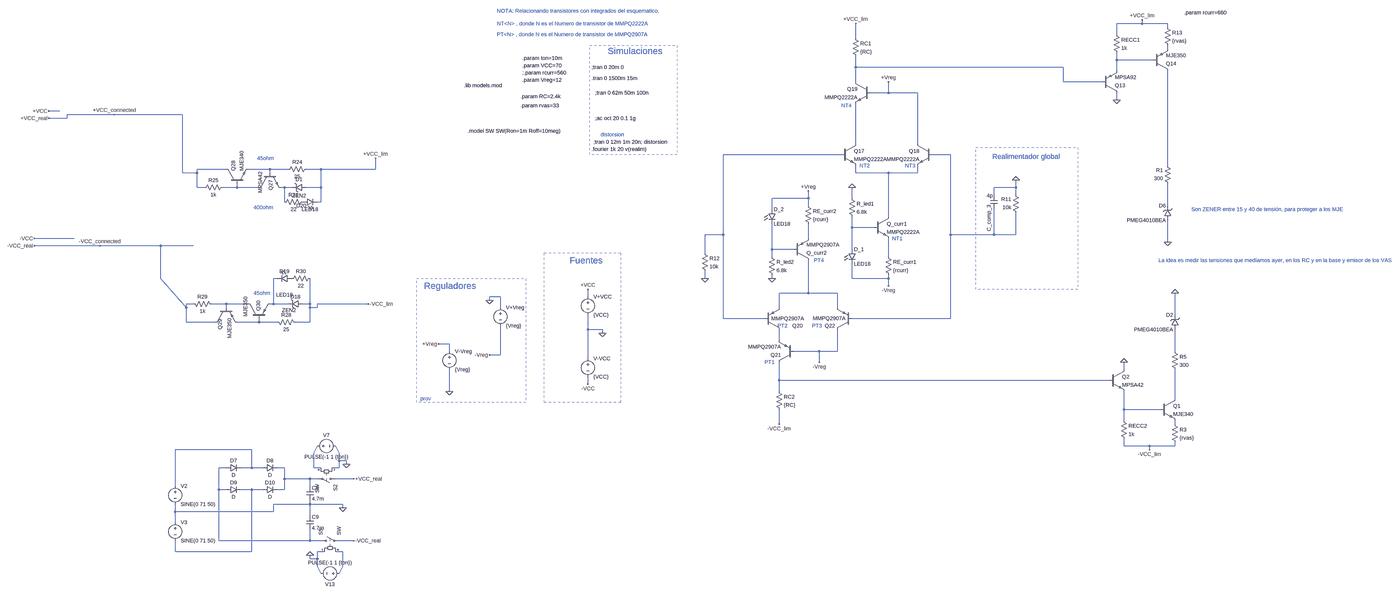
[diagram p0: schematic segunda-etapa-v2B.asc, whole sheet]
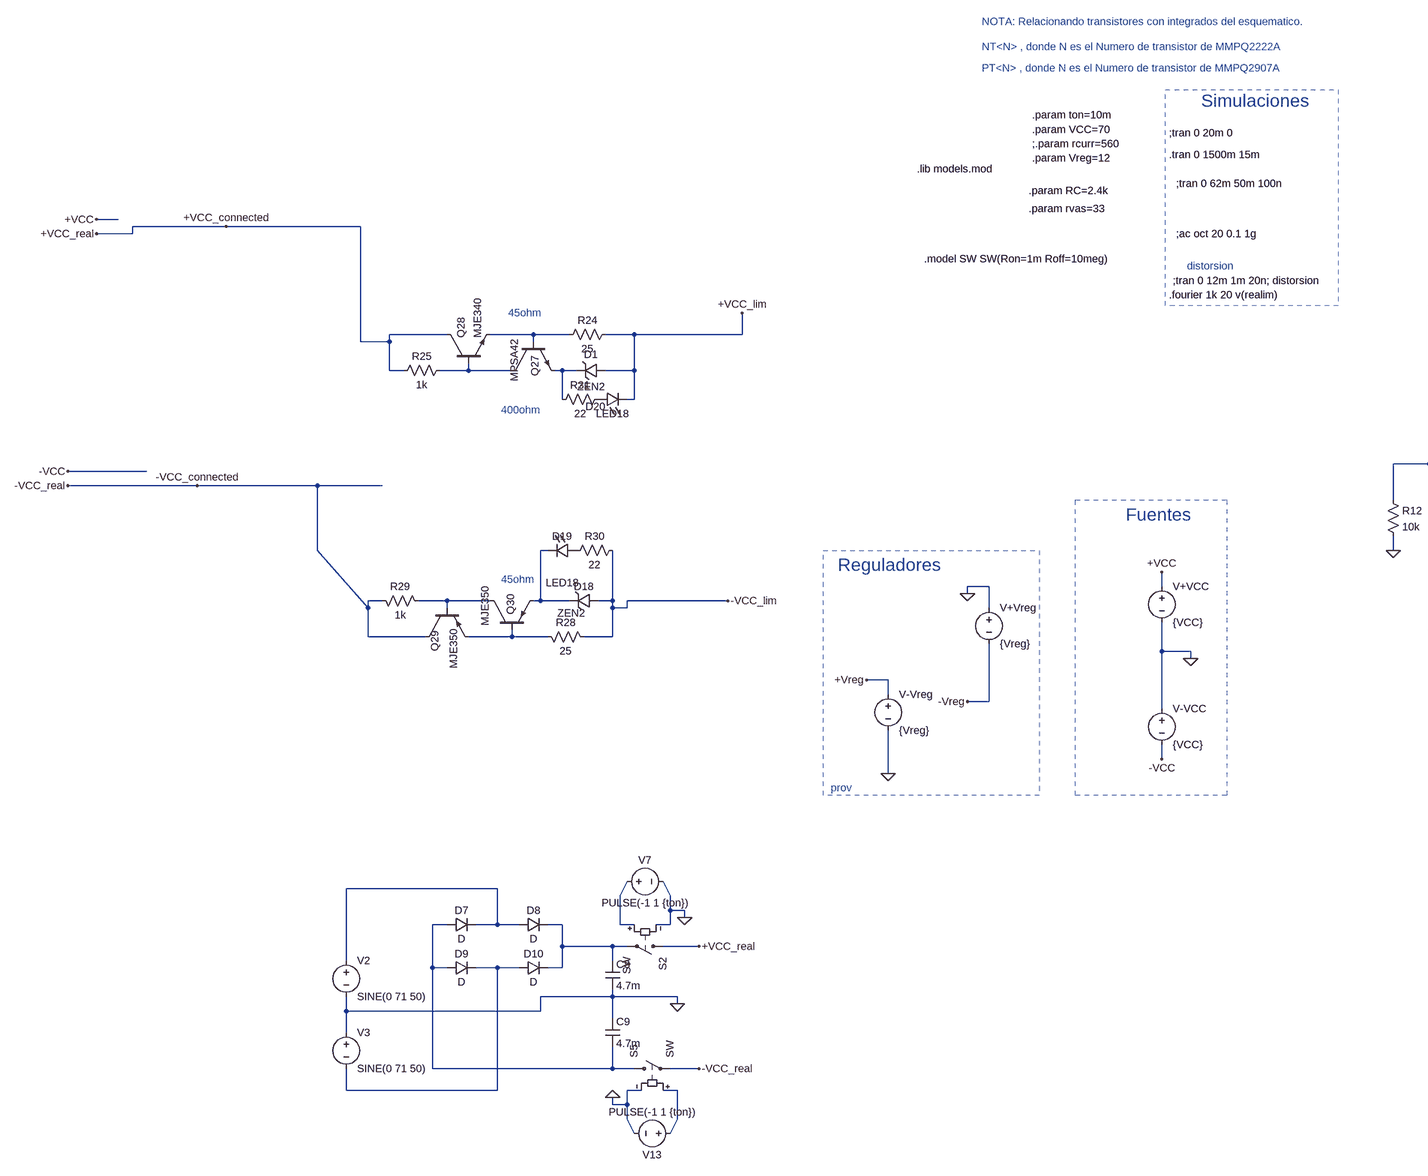
[diagram p1: schematic segunda-etapa-v2B.asc, part, row 1 of 1, column 1 of 2]
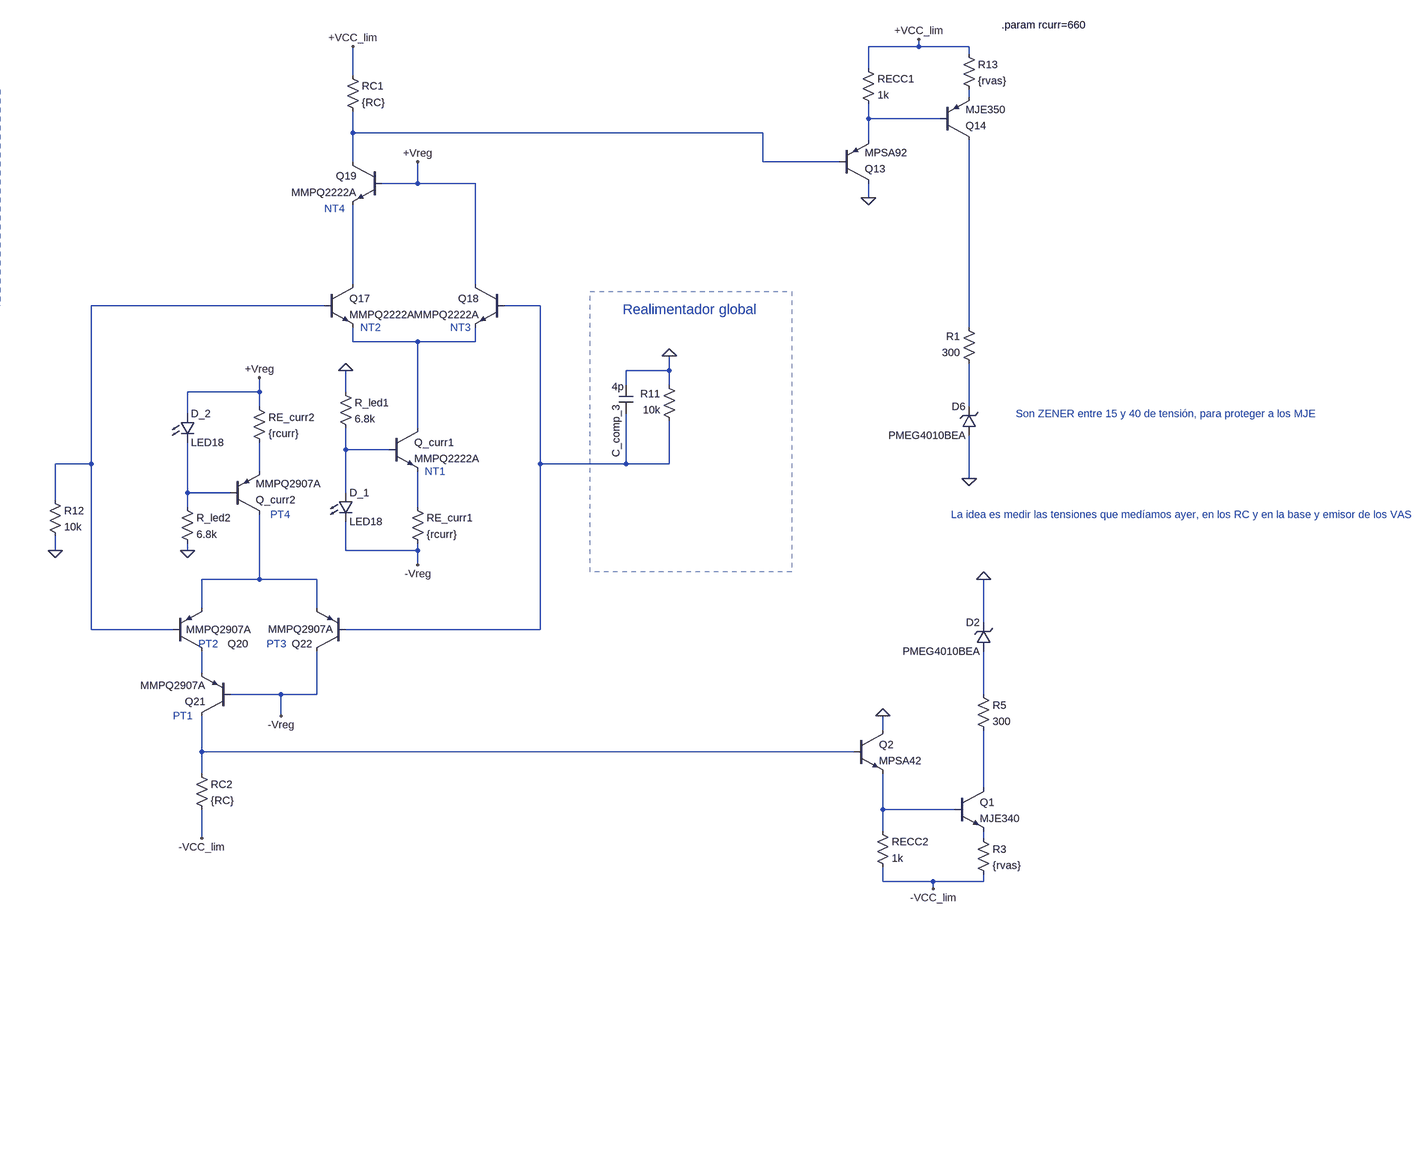
[diagram p2: schematic segunda-etapa-v2B.asc, part, row 1 of 1, column 2 of 2]
segunda-etapa-v2B.asc, the LTspice schematic file:
Version 4
SHEET 1 6132 2164
WIRE 1792 -752 1792 -768
WIRE 1792 -752 1680 -752
WIRE 1904 -752 1792 -752
WIRE 1904 -736 1904 -752
WIRE 1680 -704 1680 -752
WIRE 464 -688 464 -752
WIRE 1904 -640 1904 -656
WIRE 1680 -592 1680 -624
WIRE 1840 -592 1680 -592
WIRE 464 -560 464 -608
WIRE 1392 -560 464 -560
WIRE 1680 -544 1680 -592
WIRE 464 -496 464 -560
WIRE 1392 -496 1392 -560
WIRE 1616 -496 1392 -496
WIRE 608 -448 608 -496
WIRE 608 -448 528 -448
WIRE 736 -448 608 -448
WIRE 1680 -416 1680 -448
WIRE -3600 -368 -3648 -368
WIRE -3360 -352 -3568 -352
WIRE -3056 -352 -3360 -352
WIRE -3568 -336 -3568 -352
WIRE -3568 -336 -3648 -336
WIRE 464 -224 464 -400
WIRE 736 -224 736 -448
WIRE 400 -176 -128 -176
WIRE 880 -176 800 -176
WIRE 1904 -128 1904 -544
WIRE -2864 -112 -2992 -112
WIRE -2672 -112 -2768 -112
WIRE -2592 -112 -2672 -112
WIRE -2448 -112 -2512 -112
WIRE -2208 -112 -2208 -160
WIRE -2208 -112 -2448 -112
WIRE -3056 -96 -3056 -352
WIRE -2992 -96 -2992 -112
WIRE -2992 -96 -3056 -96
WIRE -2672 -96 -2672 -112
WIRE 464 -96 464 -128
WIRE 608 -96 464 -96
WIRE 736 -96 736 -128
WIRE 736 -96 608 -96
WIRE -2992 -32 -2992 -96
WIRE -2960 -32 -2992 -32
WIRE -2816 -32 -2816 -48
WIRE -2816 -32 -2880 -32
WIRE -2720 -32 -2816 -32
WIRE -2608 -32 -2624 -32
WIRE -2576 -32 -2608 -32
WIRE -2448 -32 -2448 -112
WIRE -2448 -32 -2512 -32
WIRE 1184 -32 1184 -64
WIRE 1184 -32 1088 -32
WIRE 1088 0 1088 -32
WIRE 1184 0 1184 -32
WIRE 256 16 256 -16
WIRE 256 16 96 16
WIRE 448 16 448 -32
WIRE -2608 32 -2608 -32
WIRE -2448 32 -2448 -32
WIRE -2448 32 -2464 32
WIRE 256 48 256 16
WIRE 1904 48 1904 -48
WIRE 96 64 96 16
WIRE 608 96 608 -96
WIRE 448 144 448 96
WIRE 544 144 448 144
WIRE -128 176 -128 -176
WIRE -128 176 -208 176
WIRE 880 176 880 -176
WIRE 1088 176 1088 64
WIRE 1088 176 880 176
WIRE 1184 176 1184 80
WIRE 1184 176 1088 176
WIRE -3536 192 -3712 192
WIRE 256 192 256 128
WIRE 1904 208 1904 112
WIRE -3424 224 -3712 224
WIRE -3152 224 -3424 224
WIRE -3008 224 -3152 224
WIRE 96 240 96 128
WIRE 192 240 96 240
WIRE 448 240 448 144
WIRE -208 256 -208 176
WIRE 96 272 96 240
WIRE 608 272 608 192
WIRE -3152 368 -3152 224
WIRE -2640 368 -2656 368
WIRE -208 368 -208 336
WIRE 96 368 96 352
WIRE 448 368 448 304
WIRE 608 368 608 352
WIRE 608 368 448 368
WIRE 608 400 608 368
WIRE 256 432 256 288
WIRE 256 432 128 432
WIRE 384 432 256 432
WIRE -1568 448 -1616 448
WIRE -1184 448 -1184 416
WIRE -1616 464 -1616 448
WIRE -3008 480 -3040 480
WIRE -2864 480 -2928 480
WIRE -2768 480 -2864 480
WIRE -2656 480 -2656 368
WIRE -2656 480 -2672 480
WIRE -2592 480 -2656 480
WIRE -2496 480 -2496 368
WIRE -2496 480 -2528 480
WIRE -2240 480 -2464 480
WIRE -3040 496 -3152 368
WIRE -3040 496 -3040 480
WIRE -2864 496 -2864 480
WIRE -2496 496 -2496 480
WIRE -2464 496 -2464 480
WIRE -2464 496 -2496 496
WIRE -1568 496 -1568 448
WIRE 128 496 128 432
WIRE 384 496 384 432
WIRE 1936 528 1936 432
WIRE -128 544 -128 176
WIRE 64 544 -128 544
WIRE 880 544 880 176
WIRE 880 544 448 544
WIRE -3040 560 -3040 496
WIRE -2912 560 -3040 560
WIRE -2720 560 -2720 544
WIRE -2720 560 -2816 560
WIRE -2640 560 -2720 560
WIRE -2496 560 -2496 496
WIRE -2496 560 -2560 560
WIRE -1184 592 -1184 528
WIRE -1120 592 -1184 592
WIRE -1120 608 -1120 592
WIRE 128 640 128 592
WIRE -1792 656 -1840 656
WIRE -1792 688 -1792 656
WIRE 304 688 192 688
WIRE 384 688 384 592
WIRE 384 688 304 688
WIRE 1936 688 1936 592
WIRE -1568 704 -1568 576
WIRE -1568 704 -1616 704
WIRE -1184 720 -1184 592
WIRE 304 736 304 688
WIRE 1712 768 1712 736
WIRE 128 816 128 736
WIRE 1648 816 128 816
WIRE -1184 832 -1184 800
WIRE -1792 864 -1792 768
WIRE 128 864 128 816
WIRE 1936 896 1936 768
WIRE 1712 944 1712 864
WIRE 1872 944 1712 944
WIRE 1712 992 1712 944
WIRE 128 1008 128 944
WIRE 1936 1008 1936 992
WIRE 1712 1104 1712 1072
WIRE 1824 1104 1712 1104
WIRE 1936 1104 1936 1088
WIRE 1936 1104 1824 1104
WIRE -2752 1120 -3088 1120
WIRE 1824 1120 1824 1104
WIRE -2480 1136 -2464 1104
WIRE -2368 1136 -2384 1104
WIRE -2368 1168 -2368 1136
WIRE -2336 1168 -2368 1168
WIRE -2336 1184 -2336 1168
WIRE -2864 1200 -2896 1200
WIRE -2752 1200 -2752 1120
WIRE -2752 1200 -2800 1200
WIRE -2704 1200 -2752 1200
WIRE -2608 1200 -2640 1200
WIRE -2480 1200 -2480 1136
WIRE -2448 1200 -2480 1200
WIRE -2368 1200 -2368 1168
WIRE -2368 1200 -2400 1200
WIRE -2608 1248 -2608 1200
WIRE -2496 1248 -2608 1248
WIRE -2464 1248 -2496 1248
WIRE -2304 1248 -2384 1248
WIRE -3088 1280 -3088 1120
WIRE -2496 1280 -2496 1248
WIRE -2896 1296 -2896 1200
WIRE -2864 1296 -2896 1296
WIRE -2752 1296 -2800 1296
WIRE -2704 1296 -2752 1296
WIRE -2608 1296 -2608 1248
WIRE -2608 1296 -2640 1296
WIRE -2496 1360 -2496 1344
WIRE -2496 1360 -2656 1360
WIRE -2352 1360 -2496 1360
WIRE -2352 1376 -2352 1360
WIRE -3088 1392 -3088 1360
WIRE -2656 1392 -2656 1360
WIRE -2656 1392 -3088 1392
WIRE -2496 1408 -2496 1360
WIRE -3088 1440 -3088 1392
WIRE -2896 1520 -2896 1296
WIRE -2496 1520 -2496 1472
WIRE -2496 1520 -2896 1520
WIRE -2448 1520 -2496 1520
WIRE -2304 1520 -2368 1520
WIRE -3088 1568 -3088 1520
WIRE -2752 1568 -2752 1296
WIRE -2752 1568 -3088 1568
WIRE -2432 1568 -2464 1568
WIRE -2352 1568 -2384 1568
WIRE -2496 1600 -2496 1584
WIRE -2464 1600 -2464 1568
WIRE -2464 1600 -2496 1600
WIRE -2464 1632 -2464 1600
WIRE -2352 1632 -2352 1568
WIRE -2448 1664 -2464 1632
WIRE -2368 1664 -2352 1632
FLAG -1120 608 0
FLAG -1184 416 +VCC
FLAG -1184 832 -VCC
FLAG -208 368 0
FLAG 1680 -416 0
FLAG -1840 656 +Vreg
FLAG -1616 704 -Vreg
FLAG 608 -496 +Vreg
FLAG 608 400 -Vreg
FLAG 256 -16 +Vreg
FLAG 304 736 -Vreg
FLAG 96 368 0
FLAG 448 -32 0
FLAG -1792 864 0
FLAG -1616 464 0
FLAG -2304 1248 +VCC_real
FLAG -2304 1520 -VCC_real
FLAG -2336 1184 0
FLAG -3360 -352 +VCC_connected
FLAG -3424 224 -VCC_connected
FLAG -3648 -368 +VCC
FLAG -3648 -336 +VCC_real
FLAG -3712 192 -VCC
FLAG -3712 224 -VCC_real
FLAG -2496 1584 0
FLAG 464 -752 +VCC_lim
FLAG 128 1008 -VCC_lim
FLAG 1792 -768 +VCC_lim
FLAG -2208 -160 +VCC_lim
FLAG -2240 480 -VCC_lim
FLAG 1184 -64 0
FLAG -2352 1376 0
FLAG 1904 208 0
FLAG 1712 736 0
FLAG 1824 1120 -VCC_lim
FLAG 1936 432 0
SYMBOL voltage -1184 432 R0
WINDOW 123 0 0 Left 2
WINDOW 39 0 0 Left 2
SYMATTR InstName V+VCC
SYMATTR Value {VCC}
SYMBOL voltage -1184 704 R0
WINDOW 123 0 0 Left 2
WINDOW 39 0 0 Left 2
SYMATTR InstName V-VCC
SYMATTR Value {VCC}
SYMBOL res 1200 96 R180
WINDOW 0 36 76 Left 2
WINDOW 3 36 40 Left 2
SYMATTR InstName R11
SYMATTR Value 10k
SYMBOL res -224 240 R0
SYMATTR InstName R12
SYMATTR Value 10k
SYMBOL pnp 1616 -448 M180
SYMATTR InstName Q13
SYMATTR Value MPSA92
SYMBOL pnp 1840 -544 M180
SYMATTR InstName Q14
SYMATTR Value MJE350
SYMBOL res 1888 -752 R0
SYMATTR InstName R13
SYMATTR Value {rvas}
SYMBOL cap 1104 64 R180
WINDOW 0 38 20 VLeft 2
WINDOW 3 21 60 Left 2
SYMATTR InstName C_comp_3
SYMATTR Value 4p
SYMBOL voltage -1568 480 R0
WINDOW 123 0 0 Left 2
WINDOW 39 0 0 Left 2
SYMATTR InstName V+Vreg
SYMATTR Value {Vreg}
SYMBOL npn 544 96 R0
SYMATTR InstName Q_curr1
SYMATTR Value MMPQ2222A
SYMBOL npn 400 -224 R0
SYMATTR InstName Q17
SYMATTR Value MMPQ2222A
SYMBOL npn 800 -224 M0
SYMATTR InstName Q18
SYMATTR Value MMPQ2222A
SYMBOL res 432 0 R0
SYMATTR InstName R_led1
SYMATTR Value 6.8k
SYMBOL res 592 256 R0
SYMATTR InstName RE_curr1
SYMATTR Value {rcurr}
SYMBOL LED 432 240 R0
SYMATTR InstName D_1
SYMATTR Value LED18
SYMBOL res 448 -704 R0
SYMATTR InstName RC1
SYMATTR Value {RC}
SYMBOL npn 528 -496 M0
SYMATTR InstName Q19
SYMATTR Value MMPQ2222A
SYMBOL res 240 32 R0
SYMATTR InstName RE_curr2
SYMATTR Value {rcurr}
SYMBOL pnp 192 288 M180
SYMATTR InstName Q_curr2
SYMATTR Value MMPQ2907A
SYMBOL pnp 64 592 M180
WINDOW 0 121 16 Left 2
WINDOW 3 29 48 Left 2
SYMATTR InstName Q20
SYMATTR Value MMPQ2907A
SYMBOL pnp 192 736 R180
SYMATTR InstName Q21
SYMATTR Value MMPQ2907A
SYMBOL res 112 848 R0
SYMATTR InstName RC2
SYMATTR Value {RC}
SYMBOL pnp 448 592 R180
WINDOW 0 74 16 Left 2
WINDOW 3 28 49 Left 2
SYMATTR InstName Q22
SYMATTR Value MMPQ2907A
SYMBOL LED 80 64 R0
SYMATTR InstName D_2
SYMATTR Value LED18
SYMBOL res 80 256 R0
SYMATTR InstName R_led2
SYMATTR Value 6.8k
SYMBOL res 1664 -720 R0
SYMATTR InstName RECC1
SYMATTR Value 1k
SYMBOL voltage -1792 672 R0
WINDOW 123 0 0 Left 2
WINDOW 39 0 0 Left 2
SYMATTR InstName V-Vreg
SYMATTR Value {Vreg}
SYMBOL voltage -3088 1264 R0
WINDOW 123 0 0 Left 2
WINDOW 39 0 0 Left 2
SYMATTR InstName V2
SYMATTR Value SINE(0 71 50)
SYMBOL diode -2864 1216 R270
WINDOW 0 32 32 VTop 2
WINDOW 3 0 32 VBottom 2
SYMATTR InstName D7
SYMBOL diode -2704 1216 R270
WINDOW 0 32 32 VTop 2
WINDOW 3 0 32 VBottom 2
SYMATTR InstName D8
SYMBOL diode -2864 1312 R270
WINDOW 0 32 32 VTop 2
WINDOW 3 0 32 VBottom 2
SYMATTR InstName D9
SYMBOL diode -2704 1312 R270
WINDOW 0 32 32 VTop 2
WINDOW 3 0 32 VBottom 2
SYMATTR InstName D10
SYMBOL cap -2512 1280 R0
SYMATTR InstName C8
SYMATTR Value 4.7m
SYMBOL voltage -3088 1424 R0
WINDOW 123 0 0 Left 2
WINDOW 39 0 0 Left 2
SYMATTR InstName V3
SYMATTR Value SINE(0 71 50)
SYMBOL cap -2512 1408 R0
SYMATTR InstName C9
SYMATTR Value 4.7m
SYMBOL sw -2368 1248 R90
SYMATTR InstName S2
SYMBOL voltage -2480 1104 R270
WINDOW 0 32 56 VTop 2
WINDOW 3 -32 56 VBottom 2
WINDOW 123 0 0 Left 2
WINDOW 39 0 0 Left 2
SYMATTR InstName V7
SYMATTR Value PULSE(-1 1 {ton})
SYMBOL sw -2464 1520 R270
SYMATTR InstName S5
SYMBOL voltage -2352 1664 R90
WINDOW 0 32 56 VTop 2
WINDOW 3 -32 56 VBottom 2
WINDOW 123 0 0 Left 2
WINDOW 39 0 0 Left 2
SYMATTR InstName V13
SYMATTR Value PULSE(-1 1 {ton})
SYMBOL res -2496 -128 R90
WINDOW 0 0 56 VBottom 2
WINDOW 3 32 56 VTop 2
SYMATTR InstName R24
SYMATTR Value 25
SYMBOL res -2864 -48 R90
WINDOW 0 0 56 VBottom 2
WINDOW 3 32 56 VTop 2
SYMATTR InstName R25
SYMATTR Value 1k
SYMBOL npn -2720 -96 M90
WINDOW 0 32 52 Left 2
WINDOW 3 -6 6 Left 2
SYMATTR InstName Q27
SYMATTR Value MPSA42
SYMBOL npn -2864 -48 R270
SYMATTR InstName Q28
SYMATTR Value MJE340
SYMBOL res -2544 576 M270
WINDOW 0 32 56 VTop 2
WINDOW 3 0 56 VBottom 2
SYMATTR InstName R28
SYMATTR Value 25
SYMBOL res -2912 496 M270
WINDOW 0 32 56 VTop 2
WINDOW 3 0 56 VBottom 2
SYMATTR InstName R29
SYMATTR Value 1k
SYMBOL pnp -2912 496 M90
WINDOW 0 51 21 Left 2
WINDOW 3 46 63 Left 2
SYMATTR InstName Q29
SYMATTR Value MJE350
SYMBOL pnp -2768 544 R270
WINDOW 0 33 46 Left 2
WINDOW 3 8 -11 Left 2
SYMATTR InstName Q30
SYMATTR Value MJE350
SYMBOL zener -2528 464 R90
WINDOW 0 0 32 VBottom 2
WINDOW 3 28 60 VTop 2
SYMATTR InstName D18
SYMATTR Value ZEN2
SYMATTR Description Light Emitting Diode
SYMATTR Type led
SYMBOL LED -2576 352 R90
WINDOW 0 0 32 VBottom 2
WINDOW 3 72 32 VTop 2
SYMATTR InstName D19
SYMATTR Value LED18
SYMBOL res -2480 352 R90
WINDOW 0 0 56 VBottom 2
WINDOW 3 32 56 VTop 2
SYMATTR InstName R30
SYMATTR Value 22
SYMBOL LED -2528 48 R270
WINDOW 0 -16 -6 VTop 2
WINDOW 3 0 32 VBottom 2
SYMATTR InstName D20
SYMATTR Value LED18
SYMBOL res -2512 16 R90
WINDOW 0 0 56 VBottom 2
WINDOW 3 32 56 VTop 2
SYMATTR InstName R31
SYMATTR Value 22
SYMBOL zener -2512 -48 R90
WINDOW 0 -4 32 VBottom 2
WINDOW 3 36 32 VTop 2
SYMATTR InstName D1
SYMATTR Value ZEN2
SYMBOL res 1920 -32 R180
WINDOW 0 36 76 Left 2
WINDOW 3 36 40 Left 2
SYMATTR InstName R1
SYMATTR Value 300
SYMBOL rui\\shortcuts\\zener 1920 112 R180
WINDOW 0 24 64 Left 2
WINDOW 3 24 0 Left 2
SYMATTR InstName D6
SYMATTR Value PMEG4010BEA
SYMBOL npn 1872 896 R0
SYMATTR InstName Q1
SYMATTR Value MJE340
SYMBOL res 1920 992 R0
SYMATTR InstName R3
SYMATTR Value {rvas}
SYMBOL npn 1648 768 R0
SYMATTR InstName Q2
SYMATTR Value MPSA42
SYMBOL res 1696 976 R0
SYMATTR InstName RECC2
SYMATTR Value 1k
SYMBOL res 1920 672 R0
SYMATTR InstName R5
SYMATTR Value 300
SYMBOL rui\\shortcuts\\zener 1952 592 R180
WINDOW 0 24 64 Left 2
WINDOW 3 24 0 Left 2
SYMATTR InstName D2
SYMATTR Value PMEG4010BEA
TEXT -1168 -560 Left 2 !;tran 0 20m 0
TEXT -1168 -200 Left 2 !.fourier 1k 20 v(realim)
TEXT -1264 288 Left 4 ;Fuentes
TEXT -1096 -632 Left 4 ;Simulaciones
TEXT -1160 -232 Left 2 !;tran 0 12m 1m 20n; distorsion
TEXT -1128 -264 Left 2 ;distorsion
TEXT -1152 -336 Left 2 !;ac oct 20 0.1 1g
TEXT -1728 -480 Left 2 !.lib models.mod
TEXT -1904 400 Left 4 ;Reguladores
TEXT -1920 896 Left 2 ;prov
TEXT 1080 -168 Left 3 ;Realimentador global
TEXT 480 -128 Left 2 ;NT2
TEXT 680 -128 Left 2 ;NT3
TEXT 624 192 Left 2 ;NT1
TEXT 400 -392 Left 2 ;NT4
TEXT 120 576 Left 2 ;PT2
TEXT -1584 -752 Left 2 ;NT<N> , donde N es el Numero de transistor de MMPQ2222A
TEXT -1584 -704 Left 2 ;PT<N> , donde N es el Numero de transistor de MMPQ2907A
TEXT -1584 -808 Left 2 ;NOTA: Relacionando transistores con integrados del esquematico.
TEXT 64 736 Left 2 ;PT1
TEXT 272 576 Left 2 ;PT3
TEXT 280 288 Left 2 ;PT4
TEXT -1472 -568 Left 2 !.param VCC=70
TEXT -1472 -504 Left 2 !.param Vreg=12
TEXT -1480 -432 Left 2 !.param RC=2.4k
TEXT -1480 -392 Left 2 !.param rvas=33
TEXT -1168 -512 Left 2 !.tran 0 1500m 15m
TEXT -1472 -600 Left 2 !.param ton=10m
TEXT -1152 -448 Left 2 !;tran 0 62m 50m 100n
TEXT -1472 -536 Left 2 !;.param rcurr=560
TEXT -2744 56 Left 2 ;400ohm
TEXT -2728 -160 Left 2 ;45ohm
TEXT -2744 432 Left 2 ;45ohm
TEXT -1712 -280 Left 2 !.model SW SW(Ron=1m Roff=10meg)
TEXT 1976 -800 Left 2 !.param rcurr=660
TEXT 2008 64 Left 2 ;Son ZENER entre 15 y 40 de tensión, para proteger a los MJE
TEXT 1864 288 Left 2 ;La idea es medir las tensiones que medíamos ayer, en los RC y en la base y emisor de los VAS
RECTANGLE Normal -1040 912 -1376 256 2
RECTANGLE Normal -792 -176 -1176 -656 2
RECTANGLE Normal -1456 912 -1936 368 2
RECTANGLE Normal 1456 416 1008 -208 2

The netlist it stands for:
* segunda-etapa-v2B.asc
V+VCC +VCC 0 {VCC}
V-VCC 0 -VCC {VCC}
R11 N006 0 10k
R12 N005 0 10k
Q13 0 N003 N002 0 MPSA92
Q14 N007 N002 N001 0 MJE350
R13 +VCC_lim N001 {rvas}
C_comp_3 N006 0 4p
V+Vreg 0 -Vreg {Vreg}
Q_curr1 N009 N013 N016 0 MMPQ2222A
Q17 N004 N005 N009 0 MMPQ2222A
Q18 +Vreg N006 N009 0 MMPQ2222A
R_led1 0 N013 6.8k
RE_curr1 N016 -Vreg {rcurr}
D_1 N013 -Vreg LED18
RC1 +VCC_lim N003 {RC}
Q19 N003 +Vreg N004 0 MMPQ2222A
RE_curr2 +Vreg N014 {rcurr}
Q_curr2 N018 N015 N014 0 MMPQ2907A
Q20 N021 N005 N018 0 MMPQ2907A
Q21 N023 -Vreg N021 0 MMPQ2907A
RC2 N023 -VCC_lim {RC}
Q22 -Vreg N006 N018 0 MMPQ2907A
D_2 +Vreg N015 LED18
R_led2 N015 0 6.8k
RECC1 +VCC_lim N002 1k
V-Vreg +Vreg 0 {Vreg}
V2 N027 0 SINE(0 71 50)
D7 N029 N027 D
D8 N027 N030 D
D9 N029 N031 D
D10 N031 N030 D
C8 N030 0 4.7m
V3 0 N031 SINE(0 71 50)
C9 0 N029 4.7m
S2 +VCC_connected N030 N028 0 SW
V7 N028 0 PULSE(-1 1 {ton})
S5 N029 -VCC_connected N032 0 SW
V13 N032 0 PULSE(-1 1 {ton})
R24 +VCC_lim N008 25
R25 N010 +VCC_connected 1k
Q27 N010 N008 N011 0 MPSA42
Q28 +VCC_connected N010 N008 0 MJE340
R28 -VCC_lim N020 25
R29 N019 -VCC_connected 1k
Q29 -VCC_connected N019 N020 0 MJE350
Q30 N019 N020 N017 0 MJE350
D18 -VCC_lim N017 ZEN2
D19 P001 N017 LED18
R30 -VCC_lim P001 22
D20 P002 +VCC_lim LED18
R31 P002 N011 22
D1 +VCC_lim N011 ZEN2
R1 N012 N007 300
D6 0 N012 PMEG4010BEA
Q1 N024 N025 N026 0 MJE340
R3 N026 -VCC_lim {rvas}
Q2 0 N023 N025 0 MPSA42
RECC2 N025 -VCC_lim 1k
R5 N022 N024 300
D2 N022 0 PMEG4010BEA
.model D D
.lib standard.dio
.model NPN NPN
.model PNP PNP
.lib standard.bjt
;tran 0 20m 0
.fourier 1k 20 v(realim)
* Fuentes
* Simulaciones
;tran 0 12m 1m 20n; distorsion
* distorsion
;ac oct 20 0.1 1g
.lib models.mod
* Reguladores
* prov
* Realimentador global
* NT2
* NT3
* NT1
* NT4
* PT2
* NT<N> , donde N es el Numero de transistor de MMPQ2222A
* PT<N> , donde N es el Numero de transistor de MMPQ2907A
* NOTA: Relacionando transistores con integrados del esquematico.
* PT1
* PT3
* PT4
.param VCC=70
.param Vreg=12
.param RC=2.4k
.param rvas=33
.tran 0 1500m 15m
.param ton=10m
;tran 0 62m 50m 100n
;.param rcurr=560
* 400ohm
* 45ohm
* 45ohm
.model SW SW(Ron=1m Roff=10meg)
.param rcurr=660
* Son ZENER entre 15 y 40 de tensión, para proteger a los MJE
* La idea es medir las tensiones que medíamos ayer, en los RC y en la base y emisor de los VAS
.backanno
.end